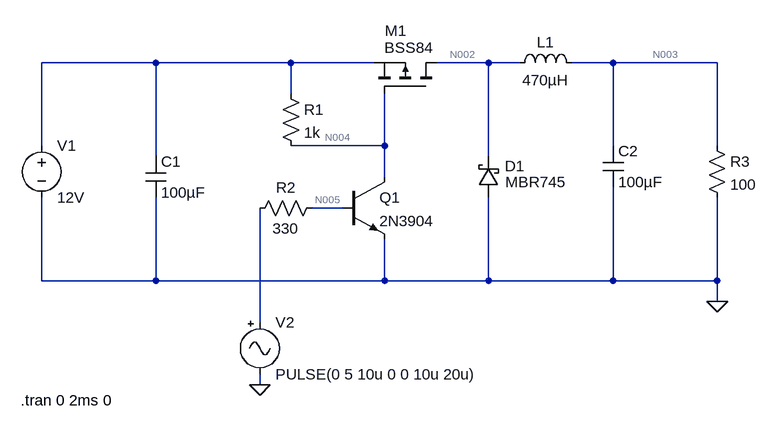
[diagram p0: schematic 21-1108_DC-DC-Lab-USAFA.asc]
21-1108_DC-DC-Lab-USAFA.asc, the LTspice schematic file:
Version 4
SHEET 1 1432 948
WIRE -128 -208 -304 -208
WIRE 80 -208 -128 -208
WIRE 208 -208 80 -208
WIRE 384 -208 304 -208
WIRE 432 -208 384 -208
WIRE 576 -208 512 -208
WIRE 736 -208 576 -208
WIRE 80 -160 80 -208
WIRE -304 -80 -304 -208
WIRE 224 -80 224 -160
WIRE 224 -80 80 -80
WIRE 576 -80 576 -208
WIRE 736 -80 736 -208
WIRE -128 -64 -128 -208
WIRE 384 -64 384 -208
WIRE 224 -32 224 -80
WIRE 160 16 112 16
WIRE -304 128 -304 0
WIRE -128 128 -128 0
WIRE -128 128 -304 128
WIRE 224 128 224 64
WIRE 224 128 -128 128
WIRE 384 128 384 0
WIRE 384 128 224 128
WIRE 576 128 576 -16
WIRE 576 128 384 128
WIRE 736 128 736 0
WIRE 736 128 576 128
WIRE 736 160 736 128
WIRE 32 192 32 16
WIRE 32 288 32 272
FLAG 736 160 0
FLAG 32 288 0
SYMBOL voltage -304 -96 R0
WINDOW 123 0 0 Left 0
WINDOW 39 0 0 Left 0
SYMATTR InstName V1
SYMATTR Value 12V
SYMBOL cap -144 -64 R0
SYMATTR InstName C1
SYMATTR Value 100µF
SYMBOL cap 560 -80 R0
SYMATTR InstName C2
SYMATTR Value 100µF
SYMBOL res 64 -176 R0
SYMATTR InstName R1
SYMATTR Value 1k
SYMBOL res 128 0 R90
WINDOW 0 0 56 VBottom 2
WINDOW 3 32 56 VTop 2
SYMATTR InstName R2
SYMATTR Value 330
SYMBOL res 720 -96 R0
SYMATTR InstName R3
SYMATTR Value 100
SYMBOL ind 416 -192 R270
WINDOW 0 32 56 VTop 2
WINDOW 3 5 56 VBottom 2
SYMATTR InstName L1
SYMATTR Value 470µH
SYMBOL npn 160 -32 R0
SYMATTR InstName Q1
SYMATTR Value 2N3904
SYMBOL schottky 400 0 R180
WINDOW 0 -40 49 Left 2
WINDOW 3 -104 24 Left 2
SYMATTR InstName D1
SYMATTR Value MBR745
SYMATTR Description Diode
SYMATTR Type diode
SYMBOL Misc\\signal 32 176 R0
WINDOW 123 0 0 Left 0
WINDOW 39 0 0 Left 0
SYMATTR InstName V2
SYMATTR Value PULSE(0 5 10u 0 0 10u 20u)
SYMBOL pmos 304 -160 M270
WINDOW 0 97 79 VLeft 2
WINDOW 3 71 80 VLeft 2
SYMATTR InstName M1
SYMATTR Value BSS84
TEXT -336 312 Left 2 !.tran 0 2ms 0

The netlist it stands for:
* 21-1108_DC-DC-Lab-USAFA.asc
V1 N001 0 12V
C1 N001 0 100µF
C2 N003 0 100µF
R1 N001 N004 1k
R2 N005 N006 330
R3 N003 0 100
L1 N002 N003 470µH
Q1 N004 N005 0 0 2N3904
D1 0 N002 MBR745
V2 N006 0 PULSE(0 5 10u 0 0 10u 20u)
M1 N002 N004 N001 N001 BSS84
.model D D
.lib standard.dio
.model NPN NPN
.model PNP PNP
.lib standard.bjt
.model NMOS NMOS
.model PMOS PMOS
.lib standard.mos
.tran 0 2ms 0
.backanno
.end

* Results of the author's LTspice run, read from the files saved beside the schematic
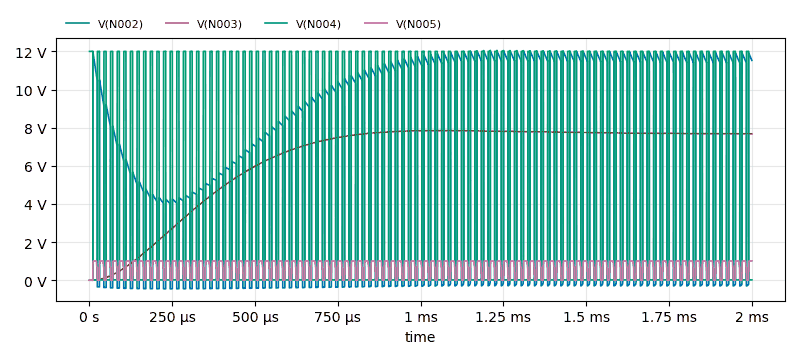
[diagram p1: Transient Analysis of 21-1108_DC-DC-Lab-USAFA.asc, plotted from the saved traces]
* Transient Analysis, 1 run:
*   V(N002): min -451.6 mV, max 12.03 V, average 6.414 V, rms 8.277 V, last 11.53 V
*   V(N003): min 0 V, max 7.848 V, average 6.39 V, rms 6.802 V, last 7.678 V
*   V(N004): min 10.84 mV, max 12.05 V, average 4.063 V, rms 6.95 V, last 15.58 mV
*   V(N005): min -292.5 µV, max 1.011 V, average 635 mV, rms 782.8 mV, last 1.011 V